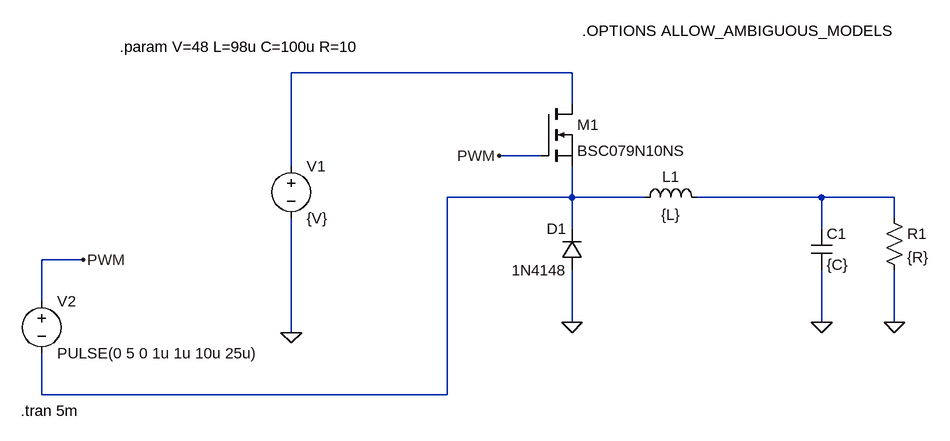
[diagram p0: schematic Buck_trials.asc]
Buck_trials.asc, the LTspice schematic file:
Version 4.1
SHEET 1 880 680
WIRE 256 0 -176 0
WIRE 256 48 256 0
WIRE 208 128 144 128
WIRE -176 144 -176 0
WIRE 256 192 256 144
WIRE 256 192 64 192
WIRE 368 192 256 192
WIRE 640 192 448 192
WIRE 752 192 640 192
WIRE 752 224 752 192
WIRE 256 240 256 192
WIRE 640 240 640 192
WIRE -496 288 -560 288
WIRE -560 352 -560 288
WIRE 256 384 256 304
WIRE 640 384 640 304
WIRE 752 384 752 304
WIRE -176 400 -176 224
WIRE -560 496 -560 432
WIRE 64 496 64 192
WIRE 64 496 -560 496
FLAG -176 400 0
FLAG 256 384 0
FLAG 640 384 0
FLAG 752 384 0
FLAG -496 288 PWM
FLAG 144 128 PWM
SYMBOL voltage -176 128 R0
WINDOW 123 0 0 Left 0
WINDOW 39 0 0 Left 0
SYMATTR InstName V1
SYMATTR Value {V}
SYMBOL ind 352 208 R270
WINDOW 0 32 56 VTop 2
WINDOW 3 5 56 VBottom 2
SYMATTR InstName L1
SYMATTR Value {L}
SYMBOL cap 624 240 R0
SYMATTR InstName C1
SYMATTR Value {C}
SYMBOL res 736 208 R0
SYMATTR InstName R1
SYMATTR Value {R}
SYMBOL voltage -560 336 R0
WINDOW 123 0 0 Left 0
WINDOW 39 0 0 Left 0
SYMATTR InstName V2
SYMATTR Value PULSE(0 5 0 1u 1u 10u 25u)
SYMBOL nmos 208 48 R0
SYMATTR InstName M1
SYMATTR Value BSC079N10NS
SYMBOL diode 272 304 R180
WINDOW 0 24 64 Left 2
WINDOW 3 24 0 Left 2
SYMATTR InstName D1
SYMATTR Value 1N4148
TEXT -440 -40 Left 2 !.param V=48 L=98u C=100u R=10
TEXT -592 520 Left 2 !.tran 5m
TEXT 272 -64 Left 2 !.OPTIONS ALLOW_AMBIGUOUS_MODELS

The netlist it stands for:
* Buck_trials.asc
V1 N001 0 {V}
L1 N002 N003 {L}
C1 N003 0 {C}
R1 N003 0 {R}
V2 PWM N002 PULSE(0 5 0 1u 1u 10u 25u)
M1 N001 PWM N002 N002 BSC079N10NS
D1 0 N002 1N4148
.model D D
.lib standard.dio
.model NMOS NMOS
.model PMOS PMOS
.lib standard.mos
.param V=48 L=98u C=100u R=10
.tran 5m
.OPTIONS ALLOW_AMBIGUOUS_MODELS
.backanno
.end